# Altium schematic sheet botpanico v1.SchDoc
size 296 x 235 mm
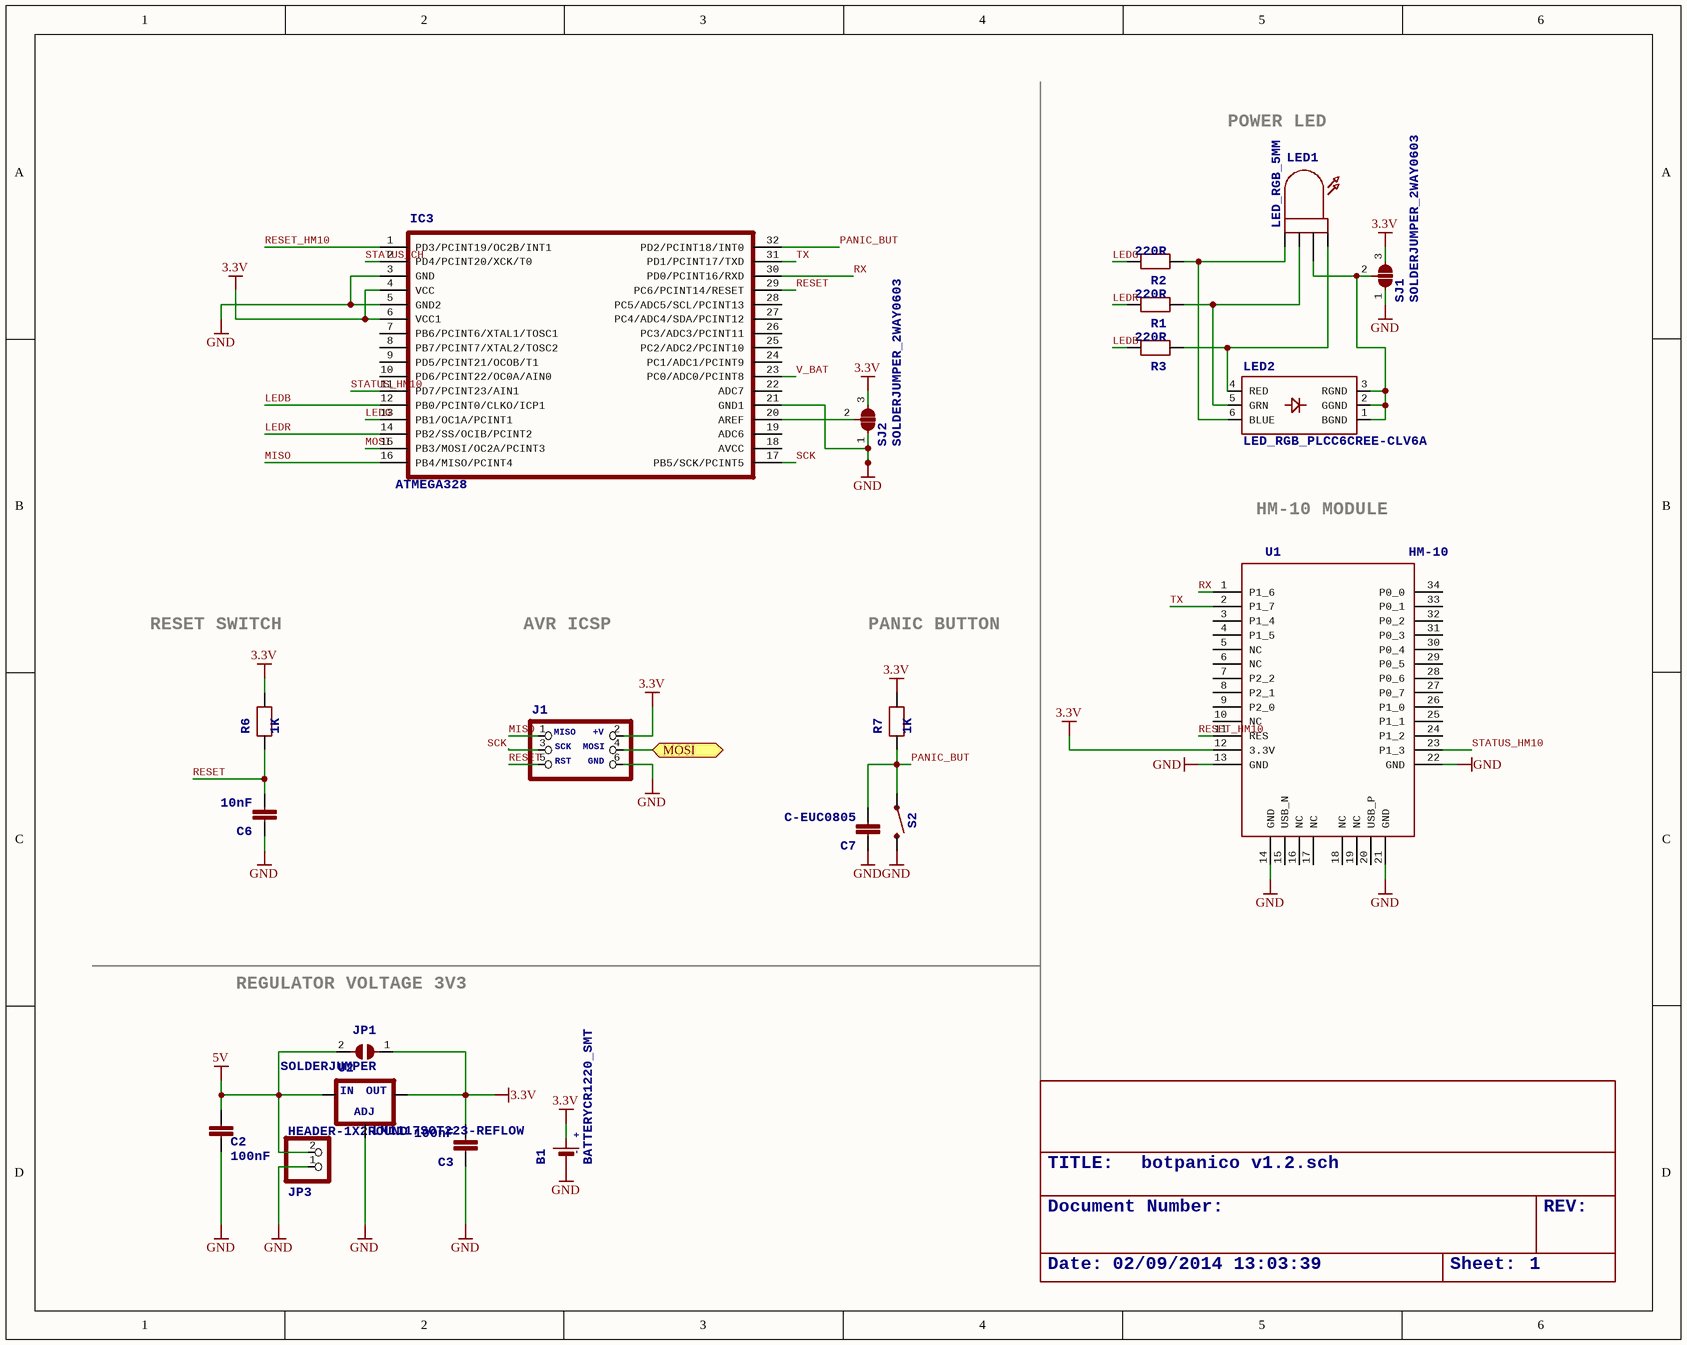
[diagram p0: botpanico v1.SchDoc]

## Parts
B1  BATTERYCR1220_SMT  [CR1220]
C2  100nF  [C0805]
C3  100nF  [C0805]
C6  10nF  [C0805]
C7  C-EUC0805  [C0805]
FRAME1  BLE112 Breakout Board v2.0  (value not drawn)  (parts A,B of 2)
IC3  ATMEGA328  [LQFP32]
J1  CON_HEADER_PRG_AVR_ICSP-SMD  [M2X3_SMD]  (value not drawn)
JP1  SOLDERJUMPER  [SOLDERJUMPER_ARROW_NOPASTE]
JP3  HEADER-1X2ROUND  [1X02_ROUND]
LED1  LED_RGB_5MM  [LEDRGB5MM]
LED2  LED_RGB_PLCC6CREE-CLV6A  [RGBLED_PLCC6]
R1  220R  [0805]
R2  220R  [0805]
R3  220R  [0805]
R6  1K  [0805]
R7  1K  [0805]
S2  SWITCH-MOMENTARY-2SMD  [TACTILE_SWITCH_SMD]  (value not drawn)
SJ1  SOLDERJUMPER_2WAY0603  [SOLDERJUMPER_2WAY_OPEN_0603]
SJ2  SOLDERJUMPER_2WAY0603  [SOLDERJUMPER_2WAY_OPEN_0603]
U1  HM-10  [HM-10]
U2  LM1117SOT223-REFLOW  [SOT223-R]

## Ports
MOSI

## Nets
3.3V: B1.+$1(+) C3.2 IC3.4(VCC) IC3.6(VCC1) J1.2(+V) JP1.1 R6.2 R7.2 SJ1.3 SJ2.3 U1.12(3.3V) U2.2(OUT)
5V: C2.2 JP1.2 JP3.2 U2.3(IN)
GND: B1.- C2.1 C3.1 C6.1 C7.1 IC3.3(GND) IC3.5(GND2) IC3.21(GND1) J1.6(GND) JP3.1 S2.3 SJ1.1 SJ2.1 U1.13(GND) U1.14(GND) U1.21(GND) U1.22(GND) U2.1(ADJ)
LEDB: IC3.12(PB0/PCINT0/CLKO/ICP1) R3.2
LEDG: IC3.13(PB1/OC1A/PCINT1) R2.2
LEDR: IC3.14(PB2/SS/OCIB/PCINT2) R1.2
MISO: IC3.16(PB4/MISO/PCINT4) J1.1(MISO)
MOSI: J1.4(MOSI) ; port MOSI
MOSI: IC3.15(PB3/MOSI/OC2A/PCINT3)  [a separate net that carries the same name]
PANIC_BUT: C7.2 IC3.32(PD2/PCINT18/INT0) R7.1 S2.1
RESET: C6.2 IC3.29(PC6/PCINT14/RESET) J1.5(RST) R6.1
RESET_HM10: IC3.1(PD3/PCINT19/OC2B/INT1) U1.11(RES)
RX: IC3.30(PD0/PCINT16/RXD) U1.1(P1_6)
SCK: IC3.17(PB5/SCK/PCINT5)
STATUS_CH: IC3.2(PD4/PCINT20/XCK/T0)
STATUS_HM10: IC3.11(PD7/PCINT23/AIN1) U1.23(P1_3)
TX: IC3.31(PD1/PCINT17/TXD) U1.2(P1_7)
V_BAT: IC3.23(PC0/ADC0/PCINT8)
NetIC3_20: IC3.20(AREF) SJ2.2
NetLED1_1: LED1.1(G) LED2.6(BLUE) R2.1
NetLED1_2: LED1.2(R) LED2.5(GRN) R1.1
NetLED1_3: LED1.3(C) LED2.1(BGND) LED2.2(GGND) LED2.3(RGND) SJ1.2
NetLED1_4: LED1.4(B) LED2.4(RED) R3.1

Not connected (* = marked no-connect by the designer): IC3 7(PB6/PCINT6/XTAL1/TOSC1) 8(PB7/PCINT7/XTAL2/TOSC2) 9(PD5/PCINT21/OCOB/T1) 10(PD6/PCINT22/OC0A/AIN0) 18(AVCC) 19(ADC6) 22(ADC7) 24(PC1/ADC1/PCINT9) 25(PC2/ADC2/PCINT10) 26(PC3/ADC3/PCINT11) 27(PC4/ADC4/SDA/PCINT12) 28(PC5/ADC5/SCL/PCINT13); J1 3(SCK); U1 3(P1_4) 4(P1_5) 5(NC) 6(NC) 7(P2_2) 8(P2_1) 9(P2_0) 10(NC) 15(USB_N) 16(NC) 17(NC) 18(NC) 19(NC) 20(USB_P) 24(P1_2) 25(P1_1) 26(P1_0) 27(P0_7) 28(P0_6) 29(P0_5) 30(P0_4) 31(P0_3) 32(P0_2) 33(P0_1) 34(P0_0)

## Notes on the sheet
- POWER LED
- HM-10 MODULE
- RESET SWITCH
- AVR ICSP
- PANIC BUTTON
- REGULATOR VOLTAGE 3V3
- Labels drawn without touching a wire or pin: SCK

## Library data of the parts
B1 = BATTERYCR1220_SMT: <p> / <ul> / <li><b>CR1220 SMT</b> - Digikey: 3001K-ND</li> / </ul> / </p>; +: +; -: -
C2 C3 C6 C7 = C-EUC0805: <B>CAPACITOR</B>, European symbol
FRAME1 = FRAME_A_L: <b>FRAME</b> A Size , 8 1/2 x 11 INCH, Landscape<p>
J1 = CON_HEADER_PRG_AVR_ICSP-SMD: 2x3 AVR ICSP programming header; MISO: MISO; SCK: SCK; RST: RST; +V: +V; MOSI: MOSI; GND: GND
JP1 = SOLDERJUMPER: <p><b>SMD Solder JUMPER</b></p> / <p>Solder the two pads together to create a connection, or remove the solder to break it.</p> / <b>REFLOW</b> - Use this footprint for solder paste and reflow ovens.<br/> / <b>WAVE</b> - Use this footprint for hand-soldering (larger pads). / <p><b>CLOSED</b> - Has a trace between the two pads to ensure it is closed by default.  The trace needs to be cut to disable the jumper, and can be closed again by creating a solder bridge between the two pads.</p>; BOM: EXCLUDE
JP3 = HEADER-1X2ROUND: <b>PIN HEADER</b>
LED2 = LED_RGB_PLCC6CREE-CLV6A: <p><b>RGB LED</b></p> / <p>Cree CLV6A-FKB - Digikey: CLV6A-FKB-CK1P1G1BB7R3R3TR-ND</p> / <ul> / <li>DC Foreward Current: 20mA</li> / <li>Foreward Voltage: R = 2.0, G = 3.2, B = 3.2</li> / <li>Viewing Angle: 120°</li> / </ul>
R1-R3 R6 R7 = RESISTOR0805: <p><b>Resistors</b></p> / <b>0402</b> - 0402 Surface Mount Package / <ul> / <li>22 Ohm 1% 1/16W [Digikey: 311-22.0LRTR-ND]</li> / <li>33 Ohm 5% 1/16W</li> / <li>1.0K 5% 1/16W</li> / <li>1.5K 5% 1/16W</li> / <li>2.0K 1% 1/16W</li> / <li>10.0K 1% 1/16W [Digikey: 311-10.0KLRTR-ND]</li> / <li>10.0K 5% 1/16W [Digikey: RMCF0402JT10K0TR-ND]</li> / <li>12.1K 1% 1/16W [Digikey: 311-22.0LRTR-ND]</li> / <li>100.0K 5% 1/16W</li> / </ul> / <b>0603</b> - 0603 Surface Mount Package<br> / <ul> / <li>0 Ohm 1/10 Watt 1% Resistor</li> / <li>15 Ohm 1/10 Watt 1% Resistor</li> / <li>33 Ohm 1/10 Watt 1% Resistor</li> / <li>49.9 Ohm 1/10 Watt 1% Resistor</li> / <li>100 Ohm 1/10 Watt 1% Resistor</li> / <li>150 Ohm 1/10 Watt 1% Resistor</li> / <li>240 Ohm 1/10 Watt 1% Resistor</li> / <li>390 Ohm 1/10 Watt 1% Resistor</li> / <li>560 Ohm 1/10 Watt 1% Resistor</li> / <li>680 Ohm 1/10 Watt 1% Resistor</li> / <li>750 Ohm 1/10 Watt 1% Resistor</li> / <li>1.0K Ohm 1/10 Watt 1% Resistor</li> / <li>1.5K Ohm 1/10 Watt 1% Resistor</li> / <li>2.0K Ohm 1/10 Watt 1% Resistor</li> / <li>2.2K Ohm 1/10 Watt 1% Resistor</li> / <li>3.3K Ohm 1/10 Watt 1% Resistor</li> / <li>4.7K Ohm 1/10 Watt 1% Resistor</li> / <li>10.0K Ohm 1/10 Watt 1% Resistor</li> / <li>12.0K Ohm 1/10 Watt 1% Resistor</li> / <li>12.1K Ohm 1/10 Watt 1% Resistor</li> / <li>20.0K Ohm 1/10 Watt 1% Resistor</li> / <li>33.0K Ohm 1/10 Watt 1% Resistor</li> / <li>100.0K Ohm 1/10 Watt 1% Resistor</li> / </ul> / <b>0805</b> - 0805 Surface Mount Package / <ul> / <li>0 Ohm 1/8 Watt 1% Resistor</li> / <li>33 Ohm 1/8 Watt 1% Resistor</li> / <li>100 Ohm 1/8 Watt 1% Resistor</li> / <li>150 Ohm 1/8 Watt 1% Resistor</li> / <li>200 Ohm 1/8 Watt 1% Resistor</li> / <li>240 Ohm 1/8 Watt 1% Resistor</li> / <li>330 Ohm 1/8 Watt 1% Resistor</li> / <li>390 Ohm 1/8 Watt 1% Resistor</li> / <li>470 Ohm 1/8 Watt 1% Resistor</li> / <li>1.0K Ohm 1/8 Watt 1% Resistor</li> / <li>1.5K Ohm 1/8 Watt 1% Resistor</li> / <li>2.0K Ohm 1/8 Watt 1% Resistor</li> / <li>4.7K Ohm 1/8 Watt 1% Resistor</li> / <li>5.1K Ohm 1/8 Watt 1% Resistor</li> / <li>5.6K Ohm 1/8 Watt 1% Resistor</li> / <li>10.0K Ohm 1/8 Watt 1% Resistor</li> / <li>22.0K Ohm 1/8 Watt 1% Resistor</li> / <li>33.0K Ohm 1/8 Watt 1% Resistor</li> / <li>100K Ohm 1/8 Watt 1% Resistor</li> / </ul> / <b>1206</b> - 1206 Surface Mount Package<br/> / <br/> / <b>2012</b> - 2010 Surface Mount Package<br/> / <ul><li>0.11 Ohm 1/2 Watt 1% Resistor - Digikey: RHM.11UCT-ND</li></ul>
S2 = SWITCH-MOMENTARY-2SMD: Various NO switches- pushbuttons, reed, etc
SJ1 SJ2 = SOLDERJUMPER_2WAY0603: <b>2-Way Solder Jumper</b>
U1 = HM-10: <b>Bluetooth_Low_Energy</b><br> / <b><p>Bluetooth 4.0 Low Energy (BLE)</p></b> / <p>The Bluetooth Board is a breakout board for HM-10 BLE module powered by a TI CC2540. / It is full programmable with CC-Debugger or SmartRF04EB.</p> / <p>Info about the BLE module can be found here: http://www.jnhuamao.cn/</p> / <p>HM-10 Datasheet can be downloaded from here:  http://www.jnhuamao.cn/bluetooth40_en.rar</p> / <p>Info about the famous CC2540 can be found on TI website http://www.ti.com/product/cc2540&DCMP=LowPowerRFICs+Other&HQS=Other+OT+cc2540</p>
U2 = LM1117SOT223-REFLOW: <b>LM1117 Voltage Regulator</b><br> / <p>LM1117 Adjustable Voltage regulator [Digikey: LM1117IMP-ADJDKR-ND]<br> / LM1117 3.3V Voltage regulator [AP1117E33GDIDKR-ND]<br> / LM1117 5.0V Voltage regulator [AP1117E50GDIDKR-ND]<br></p> / <p><b>SOT223-REFLOW</b> - SOT223 package for solder paste/reflow ovens<br/> / <b>SOT223-WAVE</b> - SOT223 package for hand-soldering (larger pads)</p> / <p>Note: For the fixed-voltage regulators, simply set the ADJ pin to GND.</p>; ADJ: ADJ; IN: IN; OUT: OUT